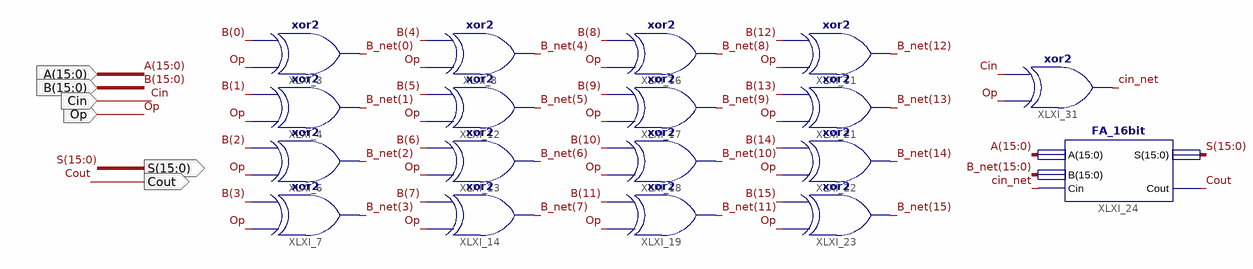
[diagram p0: schematic sheet 1]
// Xilinx ISE schematic Add16_TwosComp.sch (virtex6) as structural Verilog: 18 symbols, 6 ports
module Add16_TwosComp (
  input  Op,
  input  [15:0] A,
  input  [15:0] B,
  input  Cin,
  output [15:0] S,
  output Cout
);

  wire cin_net;
  wire [15:0] B_net;

  xor XLXI_3 (B_net[0], Op, B[0]);
  xor XLXI_4 (B_net[1], Op, B[1]);
  xor XLXI_6 (B_net[2], Op, B[2]);
  xor XLXI_7 (B_net[3], Op, B[3]);
  xor XLXI_8 (B_net[4], Op, B[4]);
  xor XLXI_12 (B_net[5], Op, B[5]);
  xor XLXI_13 (B_net[6], Op, B[6]);
  xor XLXI_14 (B_net[7], Op, B[7]);
  xor XLXI_16 (B_net[8], Op, B[8]);
  xor XLXI_17 (B_net[9], Op, B[9]);
  xor XLXI_18 (B_net[10], Op, B[10]);
  xor XLXI_19 (B_net[11], Op, B[11]);
  xor XLXI_11 (B_net[12], Op, B[12]);
  xor XLXI_21 (B_net[13], Op, B[13]);
  xor XLXI_22 (B_net[14], Op, B[14]);
  xor XLXI_23 (B_net[15], Op, B[15]);
  xor XLXI_31 (cin_net, Op, Cin);
  FA_16bit XLXI_24 (.A(A), .B(B_net), .Cin(cin_net), .S(S), .Cout(Cout));
endmodule
